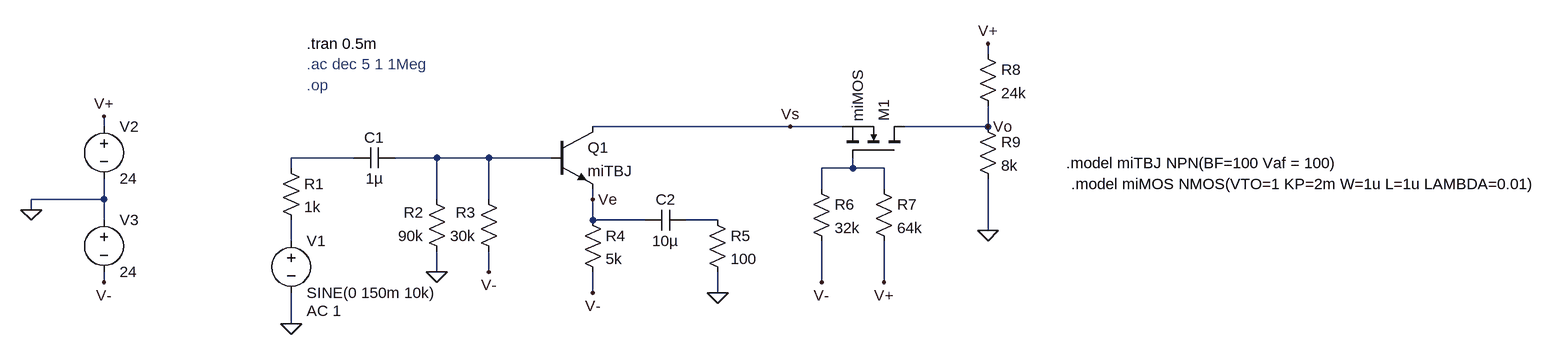
[diagram p0: schematic Simulacion.asc]
Simulacion.asc, the LTspice schematic file:
Version 4
SHEET 1 1260 680
WIRE 368 240 368 224
WIRE -992 352 -992 336
WIRE 64 352 -240 352
WIRE 144 352 64 352
WIRE 368 352 368 320
WIRE 368 352 240 352
WIRE -608 400 -704 400
WIRE -480 400 -544 400
WIRE -400 400 -480 400
WIRE -304 400 -400 400
WIRE -704 416 -704 400
WIRE 160 416 160 400
WIRE 160 416 112 416
WIRE 208 416 160 416
WIRE 112 448 112 416
WIRE 208 448 208 416
WIRE -992 464 -992 432
WIRE -992 464 -1104 464
WIRE -480 464 -480 400
WIRE -400 464 -400 400
WIRE -240 464 -240 448
WIRE -1104 480 -1104 464
WIRE -992 496 -992 464
WIRE -240 496 -240 464
WIRE -160 496 -240 496
WIRE -48 496 -96 496
WIRE 368 512 368 432
WIRE -704 528 -704 496
WIRE -480 576 -480 544
WIRE -400 576 -400 544
WIRE -992 592 -992 576
WIRE 112 592 112 528
WIRE 208 592 208 528
WIRE -240 608 -240 576
WIRE -48 608 -48 576
WIRE -704 656 -704 608
FLAG -704 656 0
FLAG -1104 480 0
FLAG -992 336 V+
FLAG -992 592 V-
FLAG -48 608 0
FLAG -480 576 0
FLAG -400 576 V-
FLAG 208 592 V+
FLAG 112 592 V-
FLAG 368 512 0
FLAG -240 608 V-
FLAG 368 224 V+
FLAG 368 352 Vo
FLAG 64 352 Vs
FLAG -240 464 Ve
SYMBOL npn -304 352 R0
SYMATTR InstName Q1
SYMATTR Value miTBJ
SYMBOL nmos 240 400 M270
SYMATTR InstName M1
SYMATTR Value miMOS
SYMBOL voltage -704 512 R0
WINDOW 123 24 124 Left 2
WINDOW 39 0 0 Left 0
SYMATTR Value2 AC 1
SYMATTR InstName V1
SYMATTR Value SINE(0 150m 10k)
SYMBOL res -720 400 R0
SYMATTR InstName R1
SYMATTR Value 1k
SYMBOL cap -544 384 R90
WINDOW 0 0 32 VBottom 2
WINDOW 3 32 32 VTop 2
SYMATTR InstName C1
SYMATTR Value 1µ
SYMBOL res -464 560 R180
WINDOW 0 36 76 Left 2
WINDOW 3 36 40 Left 2
SYMATTR InstName R2
SYMATTR Value 90k
SYMBOL res -384 560 R180
WINDOW 0 36 76 Left 2
WINDOW 3 36 40 Left 2
SYMATTR InstName R3
SYMATTR Value 30k
SYMBOL voltage -992 336 R0
WINDOW 123 0 0 Left 0
WINDOW 39 0 0 Left 0
SYMATTR InstName V2
SYMATTR Value 24
SYMBOL voltage -992 480 R0
WINDOW 123 0 0 Left 0
WINDOW 39 0 0 Left 0
SYMATTR InstName V3
SYMATTR Value 24
SYMBOL res -256 480 R0
SYMATTR InstName R4
SYMATTR Value 5k
SYMBOL cap -96 480 R90
WINDOW 0 0 32 VBottom 2
WINDOW 3 32 32 VTop 2
SYMATTR InstName C2
SYMATTR Value 10µ
SYMBOL res -64 480 R0
SYMATTR InstName R5
SYMATTR Value 100
SYMBOL res 96 432 R0
SYMATTR InstName R6
SYMATTR Value 32k
SYMBOL res 192 432 R0
SYMATTR InstName R7
SYMATTR Value 64k
SYMBOL res 352 224 R0
SYMATTR InstName R8
SYMATTR Value 24k
SYMBOL res 352 336 R0
SYMATTR InstName R9
SYMATTR Value 8k
TEXT 488 408 Left 2 !.model miTBJ NPN(BF=100 Vaf = 100)
TEXT 496 440 Left 2 !.model miMOS NMOS(VTO=1 KP=2m W=1u L=1u LAMBDA=0.01)
TEXT -680 224 Left 2 !.tran 0.5m
TEXT -680 256 Left 2 ;.ac dec 5 1 1Meg
TEXT -680 288 Left 2 ;.op

The netlist it stands for:
* Simulacion.asc
Q1 Vs N002 Ve 0 miTBJ
M1 Vo N003 Vs Vs miMOS
V1 N005 0 SINE(0 150m 10k) AC 1
R1 N001 N005 1k
C1 N002 N001 1µ
R2 0 N002 90k
R3 V- N002 30k
V2 V+ 0 24
V3 0 V- 24
R4 Ve V- 5k
C2 N004 Ve 10µ
R5 N004 0 100
R6 N003 V- 32k
R7 N003 V+ 64k
R8 V+ Vo 24k
R9 Vo 0 8k
.model NPN NPN
.model PNP PNP
.lib standard.bjt
.model NMOS NMOS
.model PMOS PMOS
.lib standard.mos
.model miTBJ NPN(BF=100 Vaf = 100)
.model miMOS NMOS(VTO=1 KP=2m W=1u L=1u LAMBDA=0.01)
.tran 0.5m
* .ac dec 5 1 1Meg
* .op
.backanno
.end